# EAGLE schematic uWave (EAGLE 6.1)

## Sheet 1 of 11
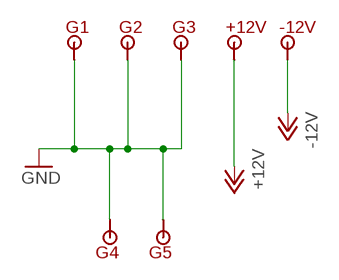
[diagram p0: schematic, sheet 1]

### Parts
+12V  TEST1X1  [TP1X1]
-12V  TEST1X1  [TP1X1]
G1  TEST1X1  [TP1X1]
G2  TEST1X1  [TP1X1]
G3  TEST1X1  [TP1X1]
G4  TEST1X1  [TP1X1]
G5  TEST1X1  [TP1X1]

### Nets
+12V: +12V.P$1 ; also sheet 2,3,4,6,11
-12V: -12V.P$1 ; also sheet 2,3,4,5,6,7,11
GND: G1.P$1 G2.P$1 G3.P$1 G4.P$1 G5.P$1 ; also sheet 2,3,4,5,6,7,10,11

## Sheet 2 of 11: +/- 12V Power Supply
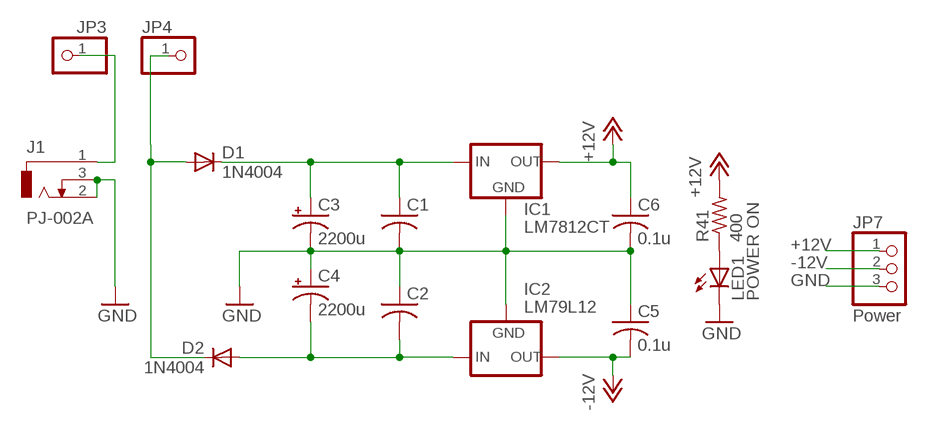
[diagram p1: schematic, sheet 2]

### Parts
C1  C-US050-024X044  [C050-024X044]
C2  C-US050-024X044  [C050-024X044]
C3  2200u  CPOL-USE7.5-16  [E7,5-16]
C4  2200u  CPOL-USE7.5-16  [E7,5-16]
C5  0.1u  C-US025-024X044  [C025-024X044]
C6  0.1u  C-US025-024X044  [C025-024X044]
D1  1N4004  [DO41-10]
D2  1N4004  [DO41-10]
IC1  LM7812CT  78XXS  [78XXS]
IC2  LM79L12  79XXS  [79XXS]
J1  PJ-002A  [PJ-002A]
JP3  PINHD-1X1  [1X01]
JP4  PINHD-1X1  [1X01]
JP7  Power  PINHD-1X3  [1X03]
LED1  POWER ON  LED3MM  [LED3MM]
R41  400  R-US_0207/10  [0207/10]

### Nets
+12V: C6.1 IC1.OUT JP7.1 R41.2 ; also sheet 1,3,4,6,11
-12V: C5.2 IC2.OUT JP7.2 ; also sheet 1,3,4,5,6,7,11
GND: C1.2 C2.1 C3.- C4.+ C5.1 C6.2 IC1.GND IC2.GND J1.2 J1.3 JP7.3 LED1.K(C) ; also sheet 1,3,4,5,6,7,10,11
N$1: C1.1 C3.+ D1.C IC1.IN
N$4: C2.2 C4.- D2.A IC2.IN
N$38: LED1.A R41.1
N$39: D1.A D2.C JP4.1
N$40: J1.1 JP3.1

## Sheet 3 of 11: Fixed Pitch Oscillator
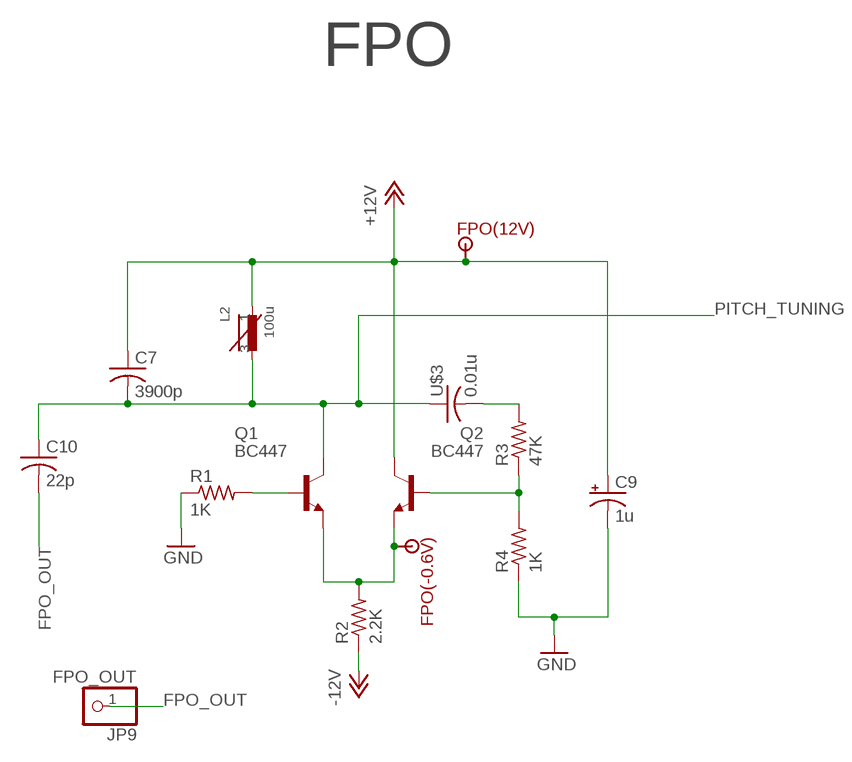
[diagram p2: schematic, sheet 3]

### Parts
C7  3900p  C-US050-075X075  [C050-075X075]
C9  1u  CPOL-USE15-5AXIAL  [E15-5]
C10  22p  C-US050-025X075  [C050-025X075]
FPO(12V)  TEST1X1  [TP1X1]
FPO(-0.6V)  TEST1X1  [TP1X1]
JP9  FPO_OUT  PINHD-1X1  [1X01]
L2  100u  TI040Z  [T1040Z]
Q1  BC447  [TO92-EBC]
Q2  BC447  [TO92-EBC]
R1  1K  R-US_0207/10  [0207/10]
R2  2.2K  R-US_0207/10  [0207/10]
R3  47K  R-US_0207/10  [0207/10]
R4  1K  R-US_0207/10  [0207/10]
U$3  0.01u  QXY103  [QXY]

### Nets
+12V: C7.1 C9.+ FPO(12V).P$1 L2.1 Q2.C ; also sheet 1,2,4,6,11
-12V: R2.1 ; also sheet 1,2,4,5,6,7,11
FPO_OUT: C10.2 JP9.1
GND: C9.- R1.1 R4.1 ; also sheet 1,2,4,5,6,7,10,11
N$2: Q1.B R1.2
N$3: Q2.B R3.1 R4.2
N$5: FPO(-0.6V).P$1 Q1.E Q2.E R2.2
N$37: R3.2 U$3.P$2
PITCH_TUNING: C7.2 C10.1 L2.3 Q1.C U$3.P$1 ; also sheet 5

### Notes on the sheet
- FPO

## Sheet 4 of 11: Variable Pitch Oscillator
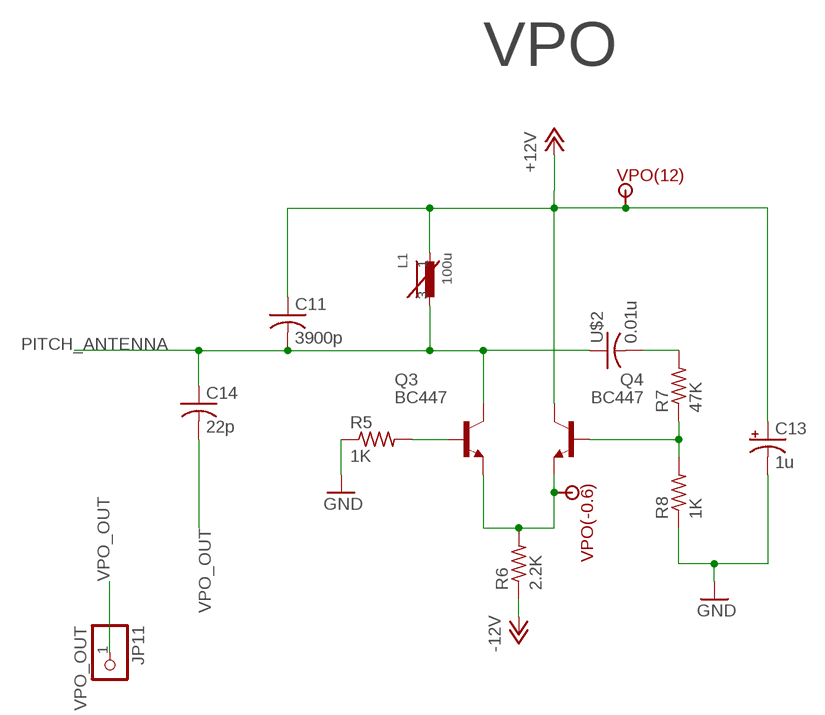
[diagram p3: schematic, sheet 4]

### Parts
C11  3900p  C-US050-075X075  [C050-075X075]
C13  1u  CPOL-USE15-5AXIAL  [E15-5]
C14  22p  C-US050-025X075  [C050-025X075]
JP11  VPO_OUT  PINHD-1X1  [1X01]
L1  100u  TI040Z  [T1040Z]
Q3  BC447  [TO92-EBC]
Q4  BC447  [TO92-EBC]
R5  1K  R-US_0207/10  [0207/10]
R6  2.2K  R-US_0207/10  [0207/10]
R7  47K  R-US_0207/10  [0207/10]
R8  1K  R-US_0207/10  [0207/10]
U$2  0.01u  QXY103  [QXY]
VPO(12)  TEST1X1  [TP1X1]
VPO(-0.6)  TEST1X1  [TP1X1]

### Nets
+12V: C11.1 C13.+ L1.1 Q4.C VPO(12).P$1 ; also sheet 1,2,3,6,11
-12V: R6.1 ; also sheet 1,2,3,5,6,7,11
GND: C13.- R5.1 R8.1 ; also sheet 1,2,3,5,6,7,10,11
N$6: Q3.B R5.2
N$7: Q4.B R7.1 R8.2
N$8: Q3.E Q4.E R6.2 VPO(-0.6).P$1
N$25: R7.2 U$2.P$2
PITCH_ANTENNA: C11.2 C14.1 L1.3 Q3.C U$2.P$1 ; also sheet 8
VPO_OUT: C14.2 JP11.1

### Notes on the sheet
- VPO

## Sheet 5 of 11: Pitch Tuning
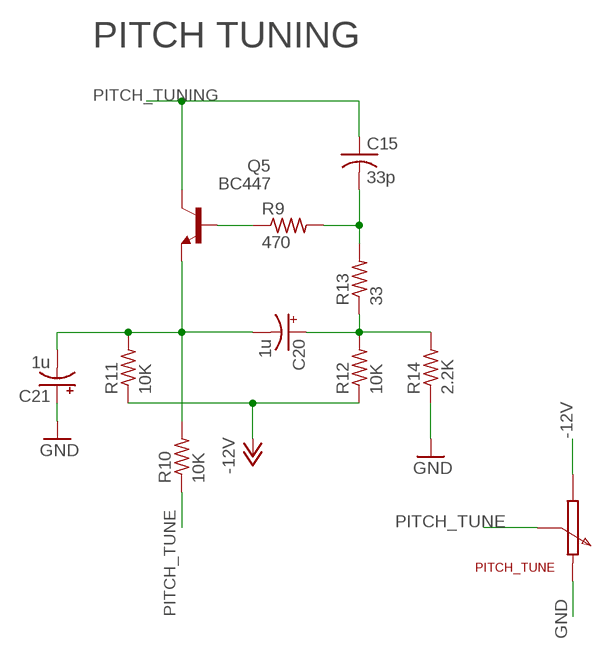
[diagram p4: schematic, sheet 5]

### Parts
C15  33p  C-US025-040X050  [C025-040X050]
C20  1u  CPOL-USE15-5AXIAL  [E15-5]
C21  1u  CPOL-USE15-5AXIAL  [E15-5]
PITCH_TUNE  POT  [EVUE]
Q5  BC447  [TO92-EBC]
R9  470  R-US_0207/10  [0207/10]
R10  10K  R-US_0207/10  [0207/10]
R11  10K  R-US_0207/10  [0207/10]
R12  10K  R-US_0207/10  [0207/10]
R13  33  R-US_0207/10  [0207/10]
R14  2.2K  R-US_0207/10  [0207/10]

### Nets
-12V: PITCH_TUNE.3 R11.1 R12.1 ; also sheet 1,2,3,4,6,7,11
GND: C21.+ PITCH_TUNE.1 R14.1 ; also sheet 1,2,3,4,6,7,10,11
N$9: C15.2 R9.2 R13.2
N$10: C20.+ R12.2 R13.1 R14.2
N$12: Q5.B R9.1
N$13: C20.- C21.- Q5.E R10.2 R11.2
PITCH_TUNE: PITCH_TUNE.2 R10.1
PITCH_TUNING: C15.1 Q5.C ; also sheet 3

### Notes on the sheet
- PITCH TUNING

## Sheet 6 of 11: Volume Oscillator
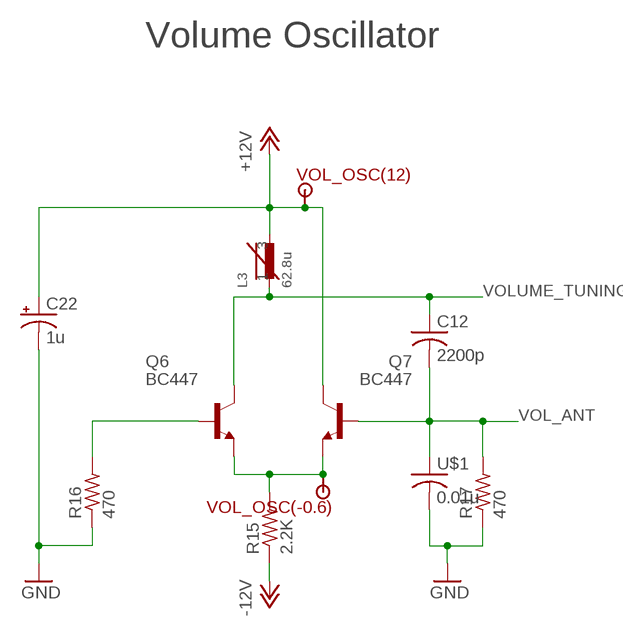
[diagram p5: schematic, sheet 6]

### Parts
C12  2200p  C-US075-032X103  [C075-032X103]
C22  1u  CPOL-USE15-5AXIAL  [E15-5]
L3  62.8u  SLOT-TEN  [SLOT-TEN-5-10]
Q6  BC447  [TO92-EBC]
Q7  BC447  [TO92-EBC]
R15  2.2K  R-US_0207/10  [0207/10]
R16  470  R-US_0207/10  [0207/10]
R17  470  R-US_0207/10  [0207/10]
U$1  0.01u  QXY103  [QXY]
VOL_OSC(12)  TEST1X1  [TP1X1]
VOL_OSC(-0.6)  TEST1X1  [TP1X1]

### Nets
+12V: C22.+ L3.3 Q7.C VOL_OSC(12).P$1 ; also sheet 1,2,3,4,11
-12V: R15.1 ; also sheet 1,2,3,4,5,7,11
GND: C22.- R16.1 R17.1 U$1.P$2 ; also sheet 1,2,3,4,5,7,10,11
N$11: Q6.E Q7.E R15.2 VOL_OSC(-0.6).P$1
N$14: Q6.B R16.2
VOL_ANT: C12.2 Q7.B R17.2 U$1.P$1 ; also sheet 9
VOLUME_TUNING: C12.1 L3.1 Q6.C ; also sheet 7

### Notes on the sheet
- Volume Oscillator

## Sheet 7 of 11: Volume Tuning
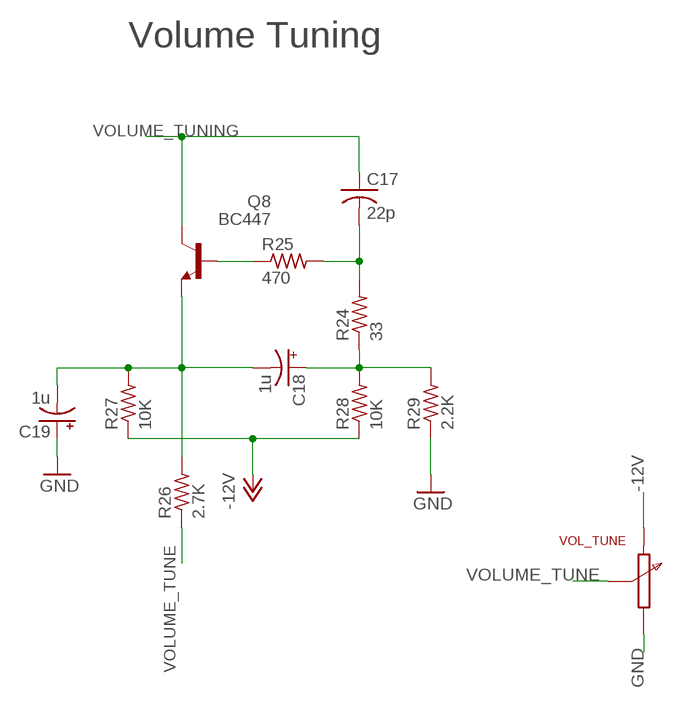
[diagram p6: schematic, sheet 7]

### Parts
C17  22p  C-US025-040X050  [C025-040X050]
C18  1u  CPOL-USE15-5AXIAL  [E15-5]
C19  1u  CPOL-USE15-5AXIAL  [E15-5]
Q8  BC447  [TO92-EBC]
R24  33  R-US_0207/10  [0207/10]
R25  470  R-US_0207/10  [0207/10]
R26  2.7K  R-US_0207/10  [0207/10]
R27  10K  R-US_0207/10  [0207/10]
R28  10K  R-US_0207/10  [0207/10]
R29  2.2K  R-US_0207/10  [0207/10]
VOL_TUNE  POT  [EVUE]

### Nets
-12V: R27.1 R28.1 VOL_TUNE.1 ; also sheet 1,2,3,4,5,6,11
GND: C19.+ R29.1 VOL_TUNE.3 ; also sheet 1,2,3,4,5,6,10,11
N$20: C17.2 R24.2 R25.2
N$21: C18.+ R24.1 R28.2 R29.2
N$22: Q8.B R25.1
N$23: C18.- C19.- Q8.E R26.2 R27.2
VOLUME_TUNE: R26.1 VOL_TUNE.2
VOLUME_TUNING: C17.1 Q8.C ; also sheet 6

### Notes on the sheet
- Volume Tuning

## Sheet 8 of 11: Pitch Antenna Circuit
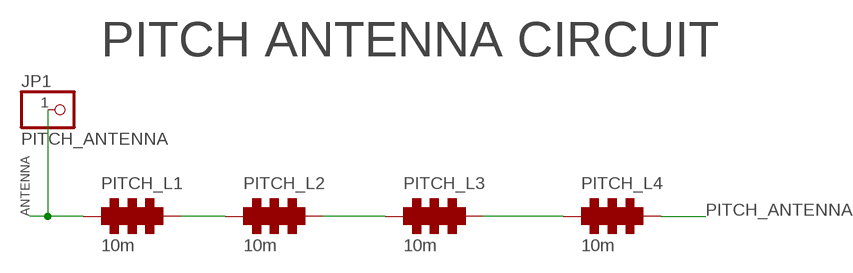
[diagram p7: schematic, sheet 8]

### Parts
JP1  PITCH_ANTENNA  PINHD-1X1  [1X01]
PITCH_L1  10m  INDUCTOR_CHOKE  [INDUCTOR_CHOKE]
PITCH_L2  10m  INDUCTOR_CHOKE  [INDUCTOR_CHOKE]
PITCH_L3  10m  INDUCTOR_CHOKE  [INDUCTOR_CHOKE]
PITCH_L4  10m  INDUCTOR_CHOKE  [INDUCTOR_CHOKE]

### Nets
ANTENNA: JP1.1 PITCH_L1.P$1
N$15: PITCH_L1.P$2 PITCH_L2.P$1
N$16: PITCH_L2.P$2 PITCH_L3.P$1
N$17: PITCH_L3.P$2 PITCH_L4.P$1
PITCH_ANTENNA: PITCH_L4.P$2 ; also sheet 4

### Notes on the sheet
- PITCH ANTENNA CIRCUIT

## Sheet 9 of 11: Volume Antenna Circuit
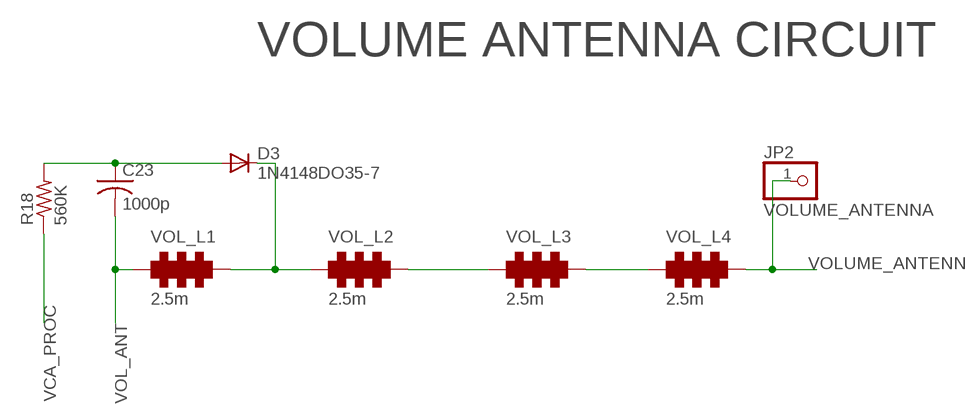
[diagram p8: schematic, sheet 9]

### Parts
C23  1000p  C-US025-024X044  [C025-024X044]
D3  1N4148DO35-7  [DO35-7]
JP2  VOLUME_ANTENNA  PINHD-1X1  [1X01]
R18  560K  R-US_0207/10  [0207/10]
VOL_L1  2.5m  INDUCTOR_CHOKE  [INDUCTOR_CHOKE]
VOL_L2  2.5m  INDUCTOR_CHOKE  [INDUCTOR_CHOKE]
VOL_L3  2.5m  INDUCTOR_CHOKE  [INDUCTOR_CHOKE]
VOL_L4  2.5m  INDUCTOR_CHOKE  [INDUCTOR_CHOKE]

### Nets
N$19: VOL_L2.P$2 VOL_L3.P$1
N$24: VOL_L3.P$2 VOL_L4.P$1
N$26: C23.1 D3.A R18.2
N$36: D3.C VOL_L1.P$2 VOL_L2.P$1
VCA_PROC: R18.1 ; also sheet 11
VOL_ANT: C23.2 VOL_L1.P$1 ; also sheet 6
VOLUME_ANTENNA: JP2.1 VOL_L4.P$2

### Notes on the sheet
- VOLUME ANTENNA CIRCUIT

## Sheet 10 of 11: Detector
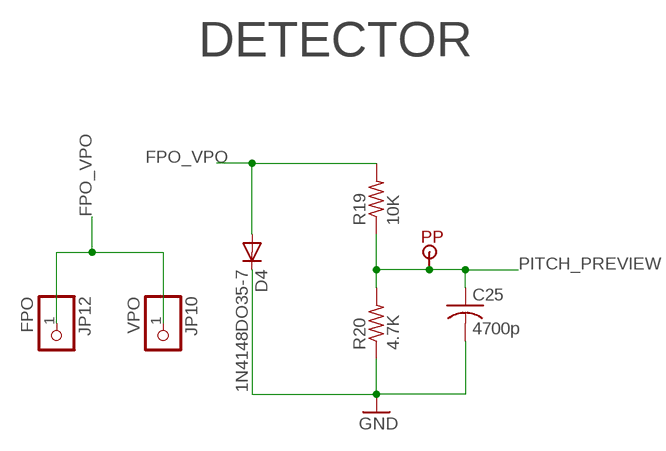
[diagram p9: schematic, sheet 10]

### Parts
C25  4700p  C-US025-025X050  [C025-025X050]
D4  1N4148DO35-7  [DO35-7]
JP10  VPO  PINHD-1X1  [1X01]
JP12  FPO  PINHD-1X1  [1X01]
PP  TEST1X1  [TP1X1]
R19  10K  R-US_0207/10  [0207/10]
R20  4.7K  R-US_0207/10  [0207/10]

### Nets
FPO_VPO: D4.A JP10.1 JP12.1 R19.2
GND: C25.2 D4.C R20.1 ; also sheet 1,2,3,4,5,6,7,11
PITCH_PREVIEW: C25.1 PP.P$1 R19.1 R20.2 ; also sheet 11

### Notes on the sheet
- DETECTOR

## Sheet 11 of 11: Volume Controlled Amplifier and Processor
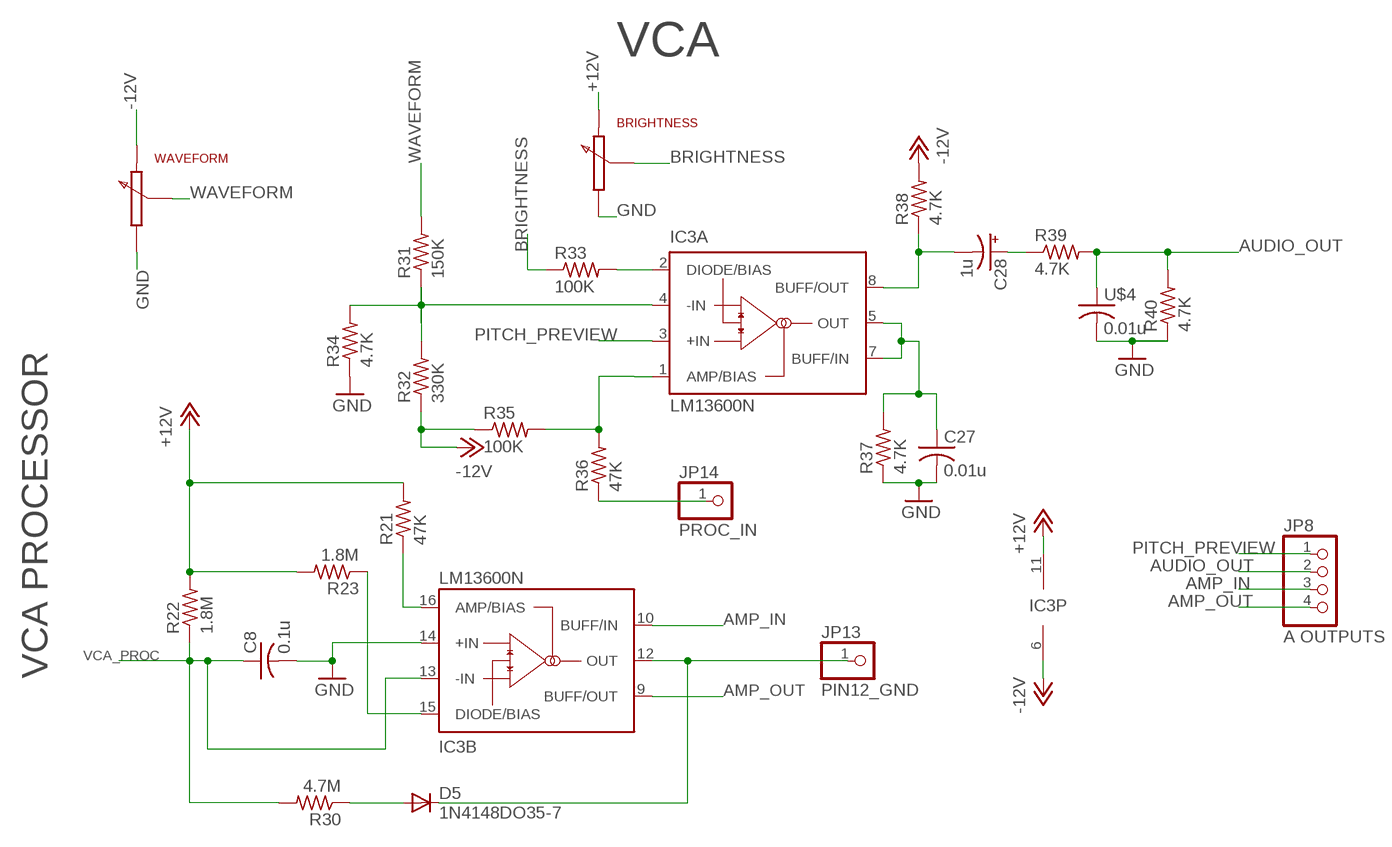
[diagram p10: schematic, sheet 11]

### Parts
BRIGHTNESS  POT  [EVUE]
C8  0.1u  C-US025-024X044  [C025-024X044]
C27  0.01u  C-US050-024X044  [C050-024X044]
C28  1u  CPOL-USE15-5AXIAL  [E15-5]
D5  1N4148DO35-7  [DO35-7]
IC3  LM13600N  [DIL16]
JP8  A OUTPUTS  PINHD-1X4  [1X04]
JP13  PIN12_GND  PINHD-1X1  [1X01]
JP14  PROC_IN  PINHD-1X1  [1X01]
R21  47K  R-US_0207/10  [0207/10]
R22  1.8M  R-US_0207/10  [0207/10]
R23  1.8M  R-US_0207/10  [0207/10]
R30  4.7M  R-US_0207/10  [0207/10]
R31  150K  R-US_0207/10  [0207/10]
R32  330K  R-US_0207/10  [0207/10]
R33  100K  R-US_0207/10  [0207/10]
R34  4.7K  R-US_0207/10  [0207/10]
R35  100K  R-US_0207/10  [0207/10]
R36  47K  R-US_0207/10  [0207/10]
R37  4.7K  R-US_0207/10  [0207/10]
R38  4.7K  R-US_0207/10  [0207/10]
R39  4.7K  R-US_0207/10  [0207/10]
R40  4.7K  R-US_0207/10  [0207/10]
U$4  0.01u  QXY103  [QXY]
WAVEFORM  POT  [EVUE]

### Nets
+12V: BRIGHTNESS.1 IC3.11(P:V+) R21.2 R22.2 R23.2 ; also sheet 1,2,3,4,6
-12V: IC3.6(P:V-) R32.1 R35.1 R38.2 WAVEFORM.1 ; also sheet 1,2,3,4,5,6,7
AMP_IN: IC3.10(B:BUFF/IN) JP8.3
AMP_OUT: IC3.9(B:BUFF/OUT) JP8.4
AUDIO_OUT: JP8.2 R39.2 R40.2 U$4.P$1
BRIGHTNESS: BRIGHTNESS.2 R33.1
GND: BRIGHTNESS.3 C8.2 C27.2 IC3.14(B:+IN) R34.1 R37.1 R40.1 U$4.P$2 WAVEFORM.3 ; also sheet 1,2,3,4,5,6,7,10
N$18: IC3.15(B:DIODE/BIAS) R23.1
N$27: C28.+ R39.1
N$28: IC3.16(B:AMP/BIAS) R21.1
N$29: IC3.2(A:DIODE/BIAS) R33.2
N$30: D5.A R30.1
N$31: IC3.4(A:-IN) R31.1 R32.2 R34.2
N$32: IC3.1(A:AMP/BIAS) R35.2 R36.2
N$33: C28.- IC3.8(A:BUFF/OUT) R38.1
N$34: D5.C IC3.12(B:OUT) JP13.1
N$35: C27.1 IC3.5(A:OUT) IC3.7(A:BUFF/IN) R37.2
N$41: JP14.1 R36.1
PITCH_PREVIEW: IC3.3(A:+IN) JP8.1 ; also sheet 10
VCA_PROC: C8.1 IC3.13(B:-IN) R22.1 R30.2 ; also sheet 9
WAVEFORM: R31.2 WAVEFORM.2

### Notes on the sheet
- VCA
- VCA PROCESSOR

## Library data of the parts
+12V -12V FPO(12V) FPO(-0.6V) G1-G5 PP VOL_OSC(12) VOL_OSC(-0.6) VPO(12) VPO(-0.6) = test:TEST1X1
BRIGHTNESS PITCH_TUNE VOL_TUNE WAVEFORM = POTENT:POT
C1 C2 C5-C8 C10-C12 C14 C15 C17 C23 C25 C27 = resistor:C-US: CAPACITOR, American symbol
C3 C4 C9 C13 C18-C22 = rcl:CPOL-US: POLARIZED CAPACITOR, American symbol
C28 = resistor:CPOL-US: POLARIZED CAPACITOR, American symbol
D1 D2 = diode:1N4004: DIODE general purpose rectifier, 1 A
D3-D5 = diode:1N4148: DIODE high speed (Philips)
IC1 = v-reg:78XXS: VOLTAGE REGULATOR
IC2 = v-reg:79XXS: VOLTAGE REGULATOR
IC3 = national-semiconductor:LM13600: Dual Operational Transconductance Amplifiers with Linearizing Diodes and Buffers Source: lm13600.PDF
J1 = pjack:PJ-002A
JP1-JP4 JP9-JP14 = pinhead:PINHD-1X1: PIN HEADER
JP7 = pinhead:PINHD-1X3: PIN HEADER
JP8 = pinhead:PINHD-1X4: PIN HEADER
L1 L2 = slot-ten:TI040Z
L3 = slot-ten:SLOT-TEN
LED1 = led:LED: LED OSRAM: - CHIPLED LG R971, LG N971, LY N971, LG Q971, LY Q971, LO R971, LY R971 LH N974, LH R974 LS Q976, LO Q976, LY Q976 LO Q996 - Hyper CHIPLED LW Q18S LB Q993, LB Q99A, LB R99A - SideLED LS A670, LO A670, LY A670, LG A670, LP A670 LB A673, LV A673, LT A673, LW A673 LH A674 LY A675 LS A676, LA A676, LO A676, LY A676, LW A676 LS A679, LY A679, LG A679 - Hyper Micro SIDELED® LS Y876, LA Y876, LO Y876, LY Y876 LT Y87S - SmartLED LW L88C, LW L88S LB L89C, LB L89S, LG L890 LS L89K, LO L89K, LY L89K LS L896, LA L896, LO L896, LY L896 - TOPLED LS T670, LO T670, LY T670, LG T670, LP T670 LSG T670, LSP T670, LSY T670, LOP T670, LYG T670 LG T671, LOG T671, LSG T671 LB T673, LV T673, LT T673, LW T673 LH T674 LS T676, LA T676, LO T676, LY T676, LB T676, LH T676, LSB T676, LW T676 LB T67C, LV T67C, LT T67C, LS T67K, LO T67K, LY T67K, LW E67C LS E67B, LA E67B, LO E67B, LY E67B, LB E67C, LV E67C, LT E67C LW T67C LS T679, LY T679, LG T679 LS T770, LO T770, LY T770, LG T770, LP T770 LB T773, LV T773, LT T773, LW T773 LH T774 LS E675, LA E675, LY E675, LS T675 LS T776, LA T776, LO T776, LY T776, LB T776 LHGB T686 LT T68C, LB T68C - Hyper Mini TOPLED® LB M676 - Mini TOPLED Santana® LG M470 LS M47K, LO M47K, LY M47K Source: http://www.osram.convergy.de LUXEON: - LUMILED® LXK2-PW12-R00, LXK2-PW12-S00, LXK2-PW14-U00, LXK2-PW14-V00 LXK2-PM12-R00, LXK2-PM12-S00, LXK2-PM14-U00 LXK2-PE12-Q00, LXK2-PE12-R00, LXK2-PE12-S00, LXK2-PE14-T00, LXK2-PE14-U00 LXK2-PB12-K00, LXK2-PB12-L00, LXK2-PB12-M00, LXK2-PB14-N00, LXK2-PB14-P00, LXK2-PB14-Q00 LXK2-PR12-L00, LXK2-PR12-M00, LXK2-PR14-Q00, LXK2-PR14-R00 LXK2-PD12-Q00, LXK2-PD12-R00, LXK2-PD12-S00 LXK2-PH12-R00, LXK2-PH12-S00 LXK2-PL12-P00, LXK2-PL12-Q00, LXK2-PL12-R00 Source: www.luxeon.com KINGBRIGHT: KA-3528ASYC Source: www.kingbright.com
PITCH_L1-PITCH_L4 VOL_L1-VOL_L4 = choke_inductor:INDUCTOR_CHOKE
Q1-Q8 = transistor-npn:BC447*: NPN Transistor
R1-R41 = resistor:R-US_: RESISTOR, American symbol
U$1-U$4 = mycap:QXY103